# Altium schematic sheet power_supply.SchDoc
size A4; SheetNumber: 4; SheetTotal: 5
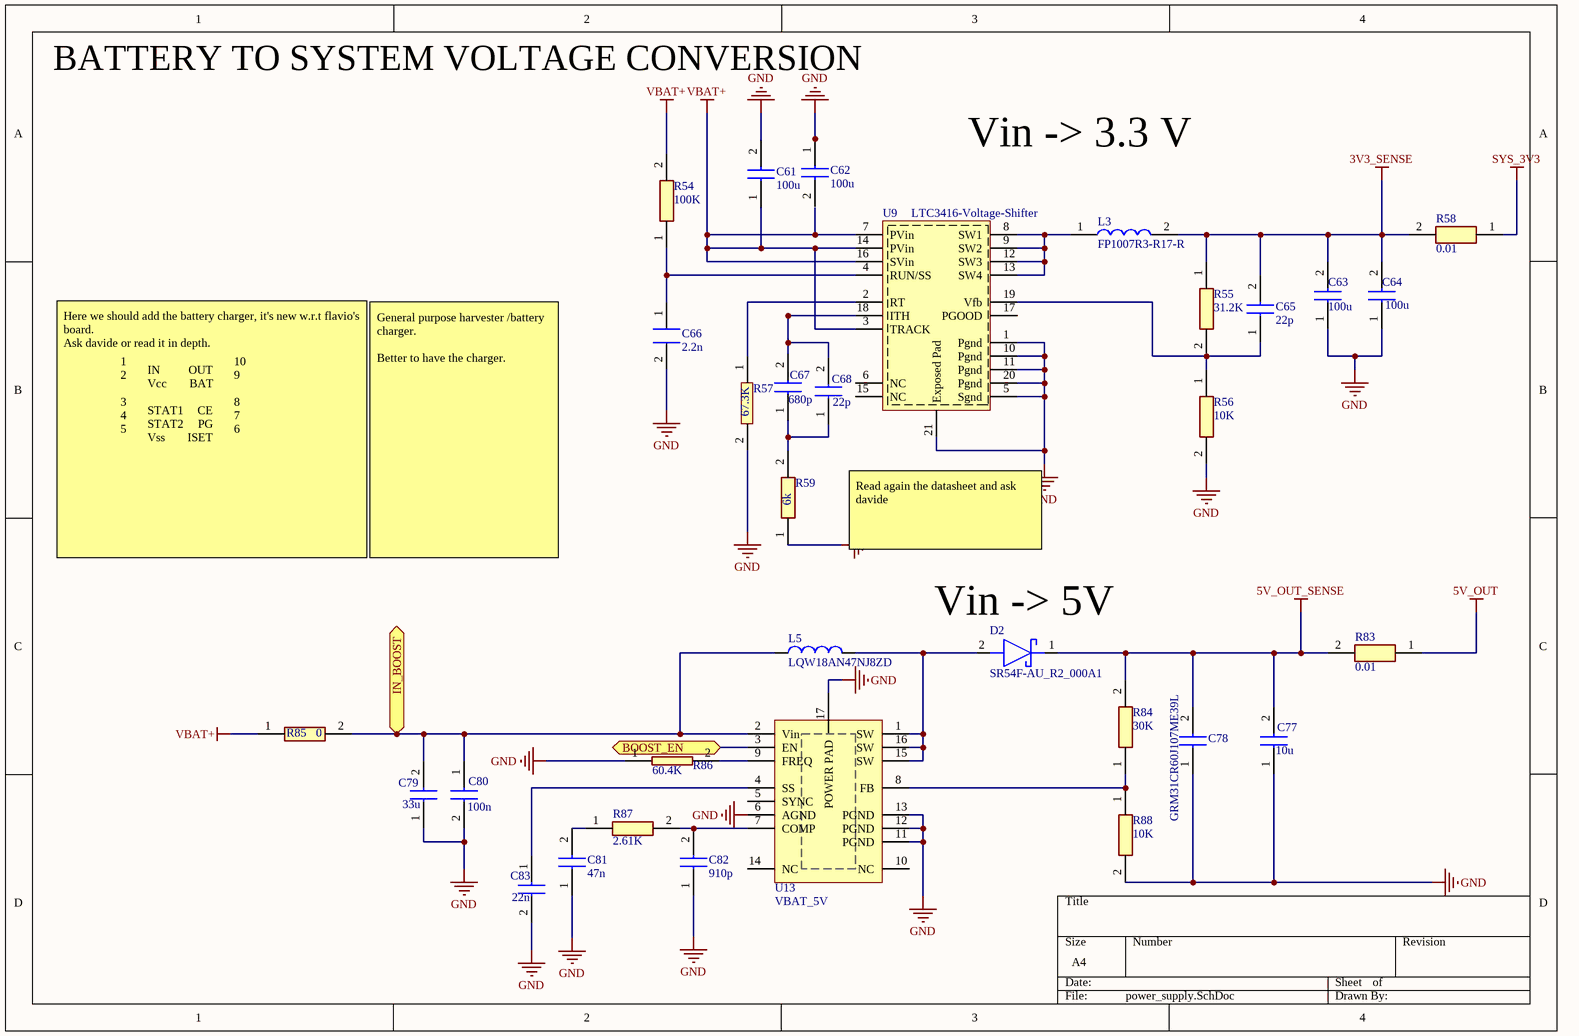
[diagram p0: power_supply.SchDoc]

## Parts
C61  100u
C62  100u
C63  100u
C64  100u
C65  22p  [CAPC0603X33N]
C66  2.2n
C67  680p  [CAPC2012X140N]
C68  22p  [CAPC0603X33N]
C77  10u  [CAPC1608X100N]
C78  GRM31CR60J107ME39L  [CAPC3216X180N]
C79  33u  [C2012_Commercial]
C80  100n  [CAPC1608X87N]
C81  47n  [CAPC2012X90N]
C82  910p
C83  22n  [CAPC2012X90N]
D2  SR54F-AU_R2_000A1  [SODFL5336X110N]
L3  FP1007R3-R17-R
L5  LQW18AN47NJ8ZD  [INDC1609X100N]
R54  100K  [RESC2012X60N]
R55  31.2K  [RESC1005X37N]
R56  10K  [ERJ3EK_(0603)]
R57  67.3K
R58  0.01
R59  6k  [ERA6A_(0805)]
R83  0.01
R84  30K  [RESC1608X55N]
R85  0  [RESC1608X55N]
R86  60.4K
R87  2.61K  [RESC1608X50N]
R88  10K  [ERJ3EK_(0603)]
U8  TI_Battery_Charger
U9  LTC3416-Voltage-Shifter
U13  VBAT_5V  [QFN50P300X300X80-17N-D]

## Ports
BOOST_EN (bidir), IN_BOOST (bidir)

## Nets
3V3_SENSE: C63.2 C64.2 C65.2 L3.2 R55.1 R58.2
5V_OUT: R83.1
5V_OUT_SENSE: C77.2 C78.2 D2.1(K) R83.2 R84.2
GND: C61.2 C62.1 C63.1 C64.1 C66.2 C77.1 C78.1 C79.1 C80.2 C81.1 C82.1 C83.2 R56.2 R57.2 R59.1 R86.1 R88.2 U9.1(Pgnd) U9.5(Sgnd) U9.10(Pgnd) U9.11(Pgnd) U9.20(Pgnd) U9.21(Exposed_Pad) U13.6(AGND) U13.11(PGND) U13.12(PGND) U13.13(PGND) U13.17(POWER_PAD)
SYS_3V3: R58.1
VBAT+: C61.1 R54.2 R85.1 U9.3(TRACK) U9.7(PVin) U9.14(PVin) U9.16(SVin)
BOOST_EN: U13.3(EN) ; port BOOST_EN
IN_BOOST: C79.2 C80.1 L5.1 R85.2 U13.2(Vin) ; port IN_BOOST
NetC65_1: C65.1 R55.2 R56.1 U9.19(Vfb)
NetC66_1: C66.1 R54.1 U9.4(RUN/SS)
NetC67_1: C67.1 C68.1 R59.2
NetC67_2: C67.2 C68.2 U9.18(ITH)
NetC81_2: C81.2 R87.1
NetC82_2: C82.2 R87.2 U13.7(COMP)
NetC83_1: C83.1 U13.4(SS)
NetD2_2: D2.2(A) L5.2 U13.1(SW) U13.15(SW) U13.16(SW)
NetL3_1: L3.1 U9.8(SW1) U9.9(SW2) U9.12(SW3) U9.13(SW4)
NetR57_1: R57.1 U9.2(RT)
NetR84_1: R84.1 R88.1 U13.8(FB)
NetR86_2: R86.2 U13.9(FREQ)

Not connected (* = marked no-connect by the designer): C62 2; U8 1(IN) 2(Vcc) 3(STAT1) 4(STAT2) 5(Vss) 6(ISET) 7(PG) 8(CE) 9(BAT) 10(OUT); U9 6(NC) 15(NC) 17(PGOOD); U13 5(SYNC) 10(NC) 14(NC)

## Notes on the sheet
- BATTERY TO SYSTEM VOLTAGE CONVERSION
- Vin -> 3.3 V
- To compute the value of Inductance here, I used the following formula:
  L = (Vout/f*deltaIl(max))(1 - (Vout/Vin(max)))
  L = (3.3V / 4MHz * 0.4(4A)) * (1 - 3.3V/5V)
  L = 0.17 uH
- (near U9) Rt = (3.08*10^11/f) - 10K with f = 4MHz.
  RT: Oscillator Resistor Input. Connecting a resistor
  to ground from this pin sets the switching frequency.
  We can decrease the frequency by increasing this resistor
- (near U9) Applying a voltage
  that is less than 0.8V to this pin enables tracking. I decided to disable this feature so I just simply connect it to high voltage
- ITH:
  Error Amplifier Compensation Point. The
  current comparator threshold increases with this control
  voltage. Nominal voltage range for this pin is from 0.2V to
  1.4V with
  This I copied from the datasheet example, we should discuss it too.
- (near U9) RUN_SS pin: Run Control and Soft-Start Input. Forcing
  this pin below 0.5V shuts down the LTC3416. I tunned this to have 1msec of start time. It can be also directly connected to VBAT.
  If we want to perform a duty cycling we should put a circuit here to decrease this to less than 0.5 V
- PGOOD:
  Power Good Output. Open-drain logic
  output that is pulled to ground when the output voltage is
  not within ±7.5% of the regulation point.
  This I didn't understand how to do it, so we should discuss it together.
  We can leave it / put a test point to use it when it's essential.
- (near R56) Vout = 0.8(1 + Rup/Rdown)
  For this example, it is:
  Vout = 0.8(1 + R55/R56) = 0.8(1+10/32) = 3.296 V
- (near U8) Here we should add the battery charger, it's new w.r.t flavio's board.
  Ask davide or read it in depth.
- General purpose harvester /battery charger.
  Better to have the charger.
- Read again the datasheet and ask davide
- (near D2) Vin -> 5V

## Library data of the parts
C61-C64 = C4532X5R0J107M280KA: TDK         C4532X5R0J107M280KA             SMD Multilayer Ceramic Capacitor, 1812 [4532 Metric], 100 F, 6.3 V,  20%, X5R, C Series; Capacitance: 100uF; Voltage Rating: 6.3V; Supplier 1: RSComponents; Supplier Part Number 1: 7416783; Manufacturer: TDK; Manufacturer Part Number: C4532X5R0J107M280KA; RoHS: Yes; Category: Ceramic Capacitors; Stock 1: 4; Mount: Surface Mount; Case/Package: 1812; Number of Pins: 2; Case Code (Metric): 4532; Case Code (Imperial): 1812; Weight: 0.000952oz; Dielectric Material: Ceramic; Min Operating Temperature: -55°C; Max Operating Temperature: 85°C; Tolerance: 20%; Packaging: Tape and Reel; Package Quantity: 1; Voltage Rating (DC): 6.3V; Dielectric: X5R; Termination: SMD/SMT; Series: C; Resistor Type: Ceramic; Voltage: 6.3V; Length: 4.5mm; Width: 0.126inch; Height: 2.8mm; Depth: 3.2mm; Thickness: 0.122inch; Radiation Hardening: No; REACH SVHC: No SVHC; Lead Free: Lead Free; RoHS Compliant: Yes; ComponentLink1URL: https://datasheet.ciiva.com/11788/0900766b80c1bb00-11788289.pdf?src-supplier=RSComponents; ComponentLink1Description: https://datasheet.ciiva.com/11788/0900766b80c1bb00-11788289.pdf?src-supplier=RSComponents; ComponentLink2URL: https://datasheet.ciiva.com/24216/c4532x5r0j107m280ka-265668-24216530.pdf?src-supplier=Mouser; ComponentLink2Description: https://datasheet.ciiva.com/24216/c4532x5r0j107m280ka-265668-24216530.pdf?src-supplier=Mouser; ComponentLink3URL: https://datasheet.ciiva.com/6283/tdkmlcccaprange-6283834.pdf?src-supplier=Digi-Key; ComponentLink3Description: https://datasheet.ciiva.com/6283/tdkmlcccaprange-6283834.pdf?src-supplier=Digi-Key; ComponentLink4URL: https://datasheet.ciiva.com/16397/e412-c-16397098.pdf?src-supplier=Future+Electronics; ComponentLink4Description: https://datasheet.ciiva.com/16397/e412-c-16397098.pdf?src-supplier=Future+Electronics; ComponentLink5URL: https://datasheet.ciiva.com/6283/tdkmlcccaprange-6283837.pdf?src-supplier=Digi-Key; ComponentLink5Description: https://datasheet.ciiva.com/6283/tdkmlcccaprange-6283837.pdf?src-supplier=Digi-Key
C65 C68 = CBR02C220F9GAC: Capacitor; Manufacturer_Name: Kemet; Datasheet Link: https://datasheet.datasheetarchive.com/originals/distributors/Datasheets-DGA10/2407502.pdf; Height: 0.33mm; Manufacturer_Part_Number: CBR02C220F9GAC
C66 = C0603C222K2RECAUTO: Cap Cer 0603 2.2nF 200V X7R 4K 7" Reel; Manufacturer: KEMET; Supplier 1: Mouser; Supplier Part Number 1: 80-C0603C222K2REAUTO; Manufacturer Part Number: C0603C222K2RECAUTO; RoHS: Yes; Category: Ceramic Capacitors; Stock 1: 16227; RoHS Compliant: Yes
C67 = C0805C681JCTACAUTO: Capacitor; Manufacturer_Name: Kemet; Datasheet Link: https://www.kemet.com/specsheet/C0805C681JCTACAUTO; Height: 1.4mm; Manufacturer_Part_Number: C0805C681JCTACAUTO
C77 = LMK107BBJ106KALT: Capacitor; Manufacturer_Name: TAIYO YUDEN; Datasheet Link: https://componentsearchengine.com//LMK107BBJ106KALT.pdf; Height: 1mm; Mouser2 Part Number: 963-LMK107BBJ106KALT; Mouser2 Price/Stock: https://www.mouser.com/Search/Refine.aspx?Keyword=963-LMK107BBJ106KALT; Manufacturer_Part_Number: LMK107BBJ106KALT
C78 = GRM31CR60J107ME39L: Capacitor; Manufacturer_Name: Murata Electronics; Datasheet Link: https://componentsearchengine.com//GRM31CR60J107ME39L.pdf; Height: 1.8mm; Mouser2 Part Number: 81-GRM31CR60J107ME9L; Mouser2 Price/Stock: https://www.mouser.com/Search/Refine.aspx?Keyword=81-GRM31CR60J107ME9L; Manufacturer_Part_Number: GRM31CR60J107ME39L
C79 = C2012X5R1A336M125AC: Capacitor; Manufacturer_Name: TDK; Datasheet Link: https://product.tdk.com/system/files/dam/doc/product/capacitor/ceramic/mlcc/catalog/mlcc_commercial_general_en.pdf; Height: 0.75mm; Manufacturer_Part_Number: C2012X5R1A336M125AC
C80 = 885012206071: Capacitor; Manufacturer_Name: Wurth Elektronik; Datasheet Link: https://katalog.we-online.com/pbs/datasheet/885012206071.pdf; Height: 0.87mm; Manufacturer_Part_Number: 885012206071
C81 = 885012207070: Capacitor; Manufacturer_Name: Wurth Elektronik; Datasheet Link: https://katalog.we-online.com/pbs/datasheet/885012207070.pdf; Height: 0.9mm; Manufacturer_Part_Number: 885012207070
C82 = 08055C911KAT2A: Cap Ceramic 910pF 50V X7R 10% SMD 0805 125°C T/R; Manufacturer: Kyocera AVX; Supplier 1: Mouser; Supplier Part Number 1: 581-08055C911KAT2A; Manufacturer Part Number: 08055C911KAT2A; RoHS: Yes; Category: Ceramic Capacitors; Stock 1: 8767; Mount: Surface Mount; Case/Package: 0805; Number of Pins: 2; Case Code (Metric): 2012; Case Code (Imperial): 0805; Min Operating Temperature: -55°C; Max Operating Temperature: 125°C; Package Quantity: 12000; Capacitance: 910pF; Voltage Rating: 50V; Tolerance: 10%; Packaging: Tape and Reel; Termination: SMD/SMT; Voltage Rating (DC): 50V; Dielectric: X7R; Length: 0.079inch; Width: 0.049inch; Thickness: 0.037inch; Depth: 1.25mm; ComponentLink1URL: https://datasheet.ciiva.com/204/cx7r-204753.pdf?src-supplier=Digi-Key; ComponentLink1Description: https://datasheet.ciiva.com/204/cx7r-204753.pdf?src-supplier=Digi-Key; ComponentLink2URL: https://datasheet.ciiva.com/13190/cx7r-13190460.pdf?src-supplier=Mouser; ComponentLink2Description: https://datasheet.ciiva.com/13190/cx7r-13190460.pdf?src-supplier=Mouser
C83 = 885012207094: Capacitor; Manufacturer_Name: Wurth Elektronik; Datasheet Link: https://componentsearchengine.com//885012207094.pdf; Height: 0.9mm; Mouser2 Part Number: 710-885012207094; Mouser2 Price/Stock: https://www.mouser.com/Search/Refine.aspx?Keyword=710-885012207094; Manufacturer_Part_Number: 885012207094
D2 = SR54F-AU_R2_000A1: Schottky Diode; Manufacturer_Name: PANJIT; Datasheet Link: https://www.mouser.jp/datasheet/2/1057/SR54F-AU-1877118.pdf; Height: 1.1mm; Manufacturer_Part_Number: SR54F-AU_R2_000A1
L3 = FP1007R3-R17-R: General Purpose Inductor, 0.17uH, 10%, 1 Element, Ferrite-Core, SMD, 4131; Manufacturer: Eaton Bussmann; Current Rating: 61A; Saturation Current: 66A; Shielding: Unshielded; Inductance: 170nH; DC Resistance (DCR): 0.29mR; Test Frequency: 100kHz; Self Resonant Frequency: 2MHz; Supplier 1: Digi-Key; Supplier Part Number 1: 513-1684-1-ND; Manufacturer Part Number: FP1007R3-R17-R; RoHS: Yes; Category: Fixed Inductors; Stock 1: 16517; Mount: Surface Mount; Case/Package: 1007; Core Material: Ferrite; Weight: 0.070548oz; Min Operating Temperature: -40°C; Max Operating Temperature: 125°C; Tolerance: 10%; Packaging: Tape and Reel; Package Quantity: 650; Max DC Current: 61A; Termination: SMD/SMT; Length: 10.2mm; Width: 7.8mm; Height: 7.3mm; Depth: 8mm; Radiation Hardening: No; Military Standard: Not; Lead Free: Lead Free; ComponentLink1URL: https://datasheet.ciiva.com/25630/0900766b8116a2db-25630987.pdf?src-supplier=RSComponents; ComponentLink1Description: https://datasheet.ciiva.com/25630/0900766b8116a2db-25630987.pdf?src-supplier=RSComponents; ComponentLink2URL: https://datasheet.ciiva.com/26858/getdatasheetpartid-711055-26858509.pdf?src-supplier=Verical; ComponentLink2Description: https://datasheet.ciiva.com/26858/getdatasheetpartid-711055-26858509.pdf?src-supplier=Verical; ComponentLink3URL: https://datasheet.ciiva.com/16439/79793630-1b1e-49f8-a6d0-ea9b2be9f2e4-16439083.pdf?src-supplier=Future+Electronics; ComponentLink3Description: https://datasheet.ciiva.com/16439/79793630-1b1e-49f8-a6d0-ea9b2be9f2e4-16439083.pdf?src-supplier=Future+Electronics
L5 = LQW18AN47NJ8ZD: FIXED IND 47NH 830MA 230 MOHM; Package: None; Price: None; Value: *; MP: LQW18AN47NJ8ZD; Availability: Unavailable
R54 = CHV0805AFX-1003ELF: Resistor; Manufacturer_Name: Bourns; Height: 0.6mm; Manufacturer_Part_Number: CHV0805AFX-1003ELF
R55 = MCS04020D3122BE100: Resistor; Manufacturer_Name: Vishay; Datasheet Link: http://www.vishay.com/docs/28705/mcx0x0xpro.pdf; Height: 0.37mm; Manufacturer_Part_Number: MCS04020D3122BE100
R56 R88 = ERJ-3EKF1002V: Resistor; Manufacturer_Name: Panasonic; Datasheet Link: https://componentsearchengine.com//ERJ-3EKF1002V.pdf; Height: 0.55mm; Mouser2 Part Number: 667-ERJ-3EKF1002V; Mouser2 Price/Stock: https://www.mouser.com/Search/Refine.aspx?Keyword=667-ERJ-3EKF1002V; Manufacturer_Part_Number: ERJ-3EKF1002V
R57 = RN732ATTD6732B25: Res 67.3K Ohm 0.1% 1/10W 0805; Manufacturer: KOA Speer; Supplier 1: Mouser; Supplier Part Number 1: 660-RN732ATTD6732B25; Manufacturer Part Number: RN732ATTD6732B25; RoHS: Yes; Category: Chip SMD Resistors; Stock 1: 2067; RoHS Compliant: Yes
R58 R83 = LVK12R010DER (2): Res Metal Alloy 1206 0.01 Ohm 0.5% 0.5W(1/2W) ±50ppm/C Pad SMD T/R; Manufacturer: Ohmite; Resistance: 10mR; Power Rating: 500mW; Temperature Coefficient: 50ppm/°C; Supplier 1: Digi-Key; Supplier Part Number 1: LVK12R010DERCT-ND; Manufacturer Part Number: LVK12R010DER; RoHS: Yes; Category: Chip SMD Resistors; Stock 1: 125609; Mount: Surface Mount; Case/Package: 1206; Case Code (Imperial): 1206; Case Code (Metric): 3216; Weight: 0.000571oz; Min Operating Temperature: -40°C; Max Operating Temperature: 125°C; Tolerance: 0.5%; Packaging: Tape and Reel; Package Quantity: 1; Resistor Type: Thick Film,Metal Film,Thin Film; Termination: SMD/SMT; Number of Terminations: 4; Max Power Dissipation: 500mW; Features: Moisture Resistant; Length: 3.2mm; Width: 1.6mm; Height: 0.5mm; Depth: 1.6mm; REACH SVHC: Unknown; RoHS Compliant: Yes; ComponentLink1URL: https://datasheet.ciiva.com/7937/575641-7937848.pdf?src-supplier=Element14; ComponentLink1Description: https://datasheet.ciiva.com/7937/575641-7937848.pdf?src-supplier=Element14; ComponentLink2URL: https://datasheet.ciiva.com/7937/575641-7937847.pdf?src-supplier=Element14; ComponentLink2Description: https://datasheet.ciiva.com/7937/575641-7937847.pdf?src-supplier=Element14; ComponentLink3URL: https://datasheet.ciiva.com/7938/lvk-7938167.pdf?src-supplier=Element14; ComponentLink3Description: https://datasheet.ciiva.com/7938/lvk-7938167.pdf?src-supplier=Element14; ComponentLink4URL: https://datasheet.ciiva.com/5469/lvk-5469173.pdf?src-supplier=Mouser; ComponentLink4Description: https://datasheet.ciiva.com/5469/lvk-5469173.pdf?src-supplier=Mouser; ComponentLink5URL: https://datasheet.ciiva.com/16756/70024650-16756989.pdf?src-supplier=Allied+Electronics; ComponentLink5Description: https://datasheet.ciiva.com/16756/70024650-16756989.pdf?src-supplier=Allied+Electronics; ComponentLink6URL: https://datasheet.ciiva.com/15865/40lvk-15865303.pdf?src-supplier=Onlinecomponents.com; ComponentLink6Description: https://datasheet.ciiva.com/15865/40lvk-15865303.pdf?src-supplier=Onlinecomponents.com; ComponentLink7URL: https://datasheet.ciiva.com/2482/res-lvk-2482375.pdf?src-supplier=Digi-Key; ComponentLink7Description: https://datasheet.ciiva.com/2482/res-lvk-2482375.pdf?src-supplier=Digi-Key; ComponentLink8URL: https://datasheet.ciiva.com/2482/res-lvk-2482376.pdf?src-supplier=Digi-Key; ComponentLink8Description: https://datasheet.ciiva.com/2482/res-lvk-2482376.pdf?src-supplier=Digi-Key; ComponentLink9URL: https://datasheet.ciiva.com/2482/res-lvk-2482374.pdf?src-supplier=Digi-Key; ComponentLink9Description: https://datasheet.ciiva.com/2482/res-lvk-2482374.pdf?src-supplier=Digi-Key
R59 = ERA-6ARB6041V: Resistor; Manufacturer_Name: Panasonic; Datasheet Link: http://industrial.panasonic.com/cdbs/www-data/pdf/RDM0000/AOA0000C307.pdf; Height: 0.6mm; Manufacturer_Part_Number: ERA-6ARB6041V
R84 = CRCW060330K0FKEAC: Resistor; Manufacturer_Name: Vishay; Datasheet Link: https://componentsearchengine.com//CRCW060330K0FKEAC.pdf; Height: 0.55mm; Mouser2 Part Number: 71-CRCW060330K0FKEAC; Mouser2 Price/Stock: https://www.mouser.com/Search/Refine.aspx?Keyword=71-CRCW060330K0FKEAC; Manufacturer_Part_Number: CRCW060330K0FKEAC
R85 = RC0603FR-070RL: Resistor; Manufacturer_Name: YAGEO (PHYCOMP); Height: 0.55mm; Manufacturer_Part_Number: RC0603FR-070RL
R86 = CRCW060360K4FKEAC: Res Thick Film 0603 60.4K Ohm 1% 1/10W ±100ppm/°C Molded SMD Paper T/R; Manufacturer: Vishay; Power Rating: 100mW; Resistance: 60.4kR; Supplier 1: Digi-Key; Supplier Part Number 1: 541-5506-1-ND; Manufacturer Part Number: CRCW060360K4FKEAC; Category: Chip SMD Resistors; Stock 1: 86964; Case/Package: 0603; Tolerance: 1%; Lead Free: Lead Free
R87 = CRCW06032K61FKEA: Resistor; Manufacturer_Name: Vishay; Datasheet Link: http://www.vishay.com/docs/20035/dcrcwe3.pdf; Height: 0.5mm; Manufacturer_Part_Number: CRCW06032K61FKEA
U8 = BQ24012DRCR: 1-cell, 1-A, linear Li-ion battery charger w/ FET, AC present & charge enable in QFN-12 10-VSON -40 to 85; Manufacturer: Texas Instruments; Output Voltage: 4.2V; Output Current: 1A; Min Supply Voltage: 3V; Max Supply Voltage: 16.5V; Number of Cells: 1; Supplier 1: Digi-Key; Supplier Part Number 1: 296-13715-1-ND; Manufacturer Part Number: BQ24012DRCR; RoHS: Yes; Category: power; Stock 1: 1348; Number of Pins: 10; Weight: 0.000885oz; Contact Plating: Gold; Min Operating Temperature: -40°C; Max Operating Temperature: 125°C; Packaging: Tape and Reel; Package Quantity: 3000; Min Input Voltage: 3V; Max Output Current: 1A; Max Charge Current: 1A; Length: 3mm; Width: 3mm; Height: 0.9mm; Radiation Hardening: No; Lead Free: Lead Free; RoHS Compliant: Yes; REACH SVHC: No SVHC; ComponentLink1URL: https://datasheet.ciiva.com/3213/bq24018-3213937.pdf?src-supplier=Avnet; ComponentLink1Description: https://datasheet.ciiva.com/3213/bq24018-3213937.pdf?src-supplier=Avnet; ComponentLink2URL: https://datasheet.ciiva.com/15114/getdatasheetpartid-256151-15114566.pdf?src-supplier=Verical; ComponentLink2Description: https://datasheet.ciiva.com/15114/getdatasheetpartid-256151-15114566.pdf?src-supplier=Verical; ComponentLink3URL: https://datasheet.ciiva.com/26875/bq24012drcr-26875237.pdf?src-supplier=IIIC; ComponentLink3Description: https://datasheet.ciiva.com/26875/bq24012drcr-26875237.pdf?src-supplier=IIIC; ComponentLink4URL: https://datasheet.ciiva.com/22642/1862453-22642958.pdf?src-supplier=Element14; ComponentLink4Description: https://datasheet.ciiva.com/22642/1862453-22642958.pdf?src-supplier=Element14; ComponentLink5URL: https://datasheet.ciiva.com/1932/bq24014-1932389.pdf?src-supplier=Digi-Key; ComponentLink5Description: https://datasheet.ciiva.com/1932/bq24014-1932389.pdf?src-supplier=Digi-Key; ComponentLink6URL: https://datasheet.ciiva.com/1932/bq24014-1932388.pdf?src-supplier=Digi-Key; ComponentLink6Description: https://datasheet.ciiva.com/1932/bq24014-1932388.pdf?src-supplier=Digi-Key; ComponentLink7URL: https://datasheet.ciiva.com/1932/bq24014-1932390.pdf?src-supplier=Digi-Key; ComponentLink7Description: https://datasheet.ciiva.com/1932/bq24014-1932390.pdf?src-supplier=Digi-Key; ComponentLink8URL: https://datasheet.ciiva.com/26250/bq24012-26250366.pdf?src-supplier=Avnet+Europe; ComponentLink8Description: https://datasheet.ciiva.com/26250/bq24012-26250366.pdf?src-supplier=Avnet+Europe; category: Battery
U9 = LTC3416EFE#PBF: Conv DC-DC 2.25V to 5.5V Synchronous Step Down Single-Out 0.8V to 5V 4A Automotive 20-Pin TSSOP EP; Manufacturer: Analog Devices; Efficiency: 95%; Number of Outputs: 1; Switching Frequency: 4MHz; Synchronous Rectifier: Yes; Min Output Voltage: 800mV; Output Type: Adjustable; Output Configuration: Positive; Supplier 1: Digi-Key; Supplier Part Number 1: LTC3416EFE#PBF-ND; Manufacturer Part Number: LTC3416EFE#PBF; Category: Power; Stock 1: 1587; Mount: Surface Mount; Case/Package: TSSOP; Number of Pins: 20; Min Operating Temperature: -40°C; Max Operating Temperature: 85°C; Min Input Voltage: 2.25V; Max Output Current: 4A; Max Input Voltage: 5.5V; Output Voltage: 5V; Output Current: 4A; Package Quantity: 74; Packaging: Rail/Tube; Max Output Voltage: 5V; Series: -; Length: 6.6mm; Width: 4.5mm; Height: 1.05mm; Radiation Hardening: No; REACH SVHC: No SVHC; Lead Free: Lead Free; RoHS Compliant: Yes; ComponentLink1URL: https://datasheet.ciiva.com/2025/2995-2025099.pdf?src-supplier=Digi-Key; ComponentLink1Description: https://datasheet.ciiva.com/2025/2995-2025099.pdf?src-supplier=Digi-Key; ComponentLink2URL: https://datasheet.ciiva.com/15112/getdatasheetpartid-82273-15112776.pdf?src-supplier=Verical; ComponentLink2Description: https://datasheet.ciiva.com/15112/getdatasheetpartid-82273-15112776.pdf?src-supplier=Verical; ComponentLink3URL: https://datasheet.ciiva.com/26898/ltc3416efe-pbf-26898981.pdf?src-supplier=IIIC; ComponentLink3Description: https://datasheet.ciiva.com/26898/ltc3416efe-pbf-26898981.pdf?src-supplier=IIIC; ComponentLink4URL: https://datasheet.ciiva.com/7312/1727688-7312092.pdf?src-supplier=Newark; ComponentLink4Description: https://datasheet.ciiva.com/7312/1727688-7312092.pdf?src-supplier=Newark; ComponentLink5URL: https://datasheet.octopart.com/LTC3416EFE%23PBF-Analog-Devices-datasheet-17021874.pdf?src-supplier=Linear+Technology; ComponentLink5Description: https://datasheet.octopart.com/LTC3416EFE%23PBF-Analog-Devices-datasheet-17021874.pdf?src-supplier=Linear+Technology; ComponentLink6URL: https://sigma.octopart.com/57693649/technical_drawing/Linear-Technology-LTC3416EFE%23PBF.pdf?src-supplier=Linear+Technology; ComponentLink6Description: https://sigma.octopart.com/57693649/technical_drawing/Linear-Technology-LTC3416EFE%23PBF.pdf?src-supplier=Linear+Technology; ComponentLink7URL: https://datasheet.octopart.com/LTC3416EFE%23PBF-Linear-Technology-datasheet-604372.pdf?src-supplier=Element14; ComponentLink7Description: https://datasheet.octopart.com/LTC3416EFE%23PBF-Linear-Technology-datasheet-604372.pdf?src-supplier=Element14; ComponentLink8URL: https://datasheet.octopart.com/LTC3416EFE%23PBF-Linear-Technology-datasheet-14167519.pdf?src-supplier=IIIC; ComponentLink8Description: https://datasheet.octopart.com/LTC3416EFE%23PBF-Linear-Technology-datasheet-14167519.pdf?src-supplier=IIIC
U13 = TPS55340QRTERQ1: Conv DC-DC 2.9V to 38V Step Up Single-Out 2.9V to 38V 5A Automotive 16-Pin WQFN EP T/R; Manufacturer: Texas Instruments; Number of Outputs: 1; Output Current: 5.25A; Switching Frequency: 2.55MHz; Synchronous Rectifier: No; Quiescent Current: 500uA; Topology: Boost,Flyback,SEPIC; Output Type: Adjustable; Supplier 1: Mouser; Supplier Part Number 1: 595-TPS55340QRTERQ1; Manufacturer Part Number: TPS55340QRTERQ1; RoHS: Yes; Category: Power Supply Modules; Stock 1: 60; Mount: Surface Mount; Number of Pins: 16; Contact Plating: Gold; Min Operating Temperature: -40°C; Max Operating Temperature: 125°C; Packaging: Tape and Reel; Output Voltage: 38V; Max Output Current: 5A; Min Input Voltage: 2.9V; Max Input Voltage: 38V; Min Output Voltage: 2.9V; Max Output Voltage: 38V; Operating Supply Voltage: 38V; Lead Free: Lead Free; RoHS Compliant: Yes; ComponentLink1URL: http://components.arrow.com/part/dataview/66951772S909397N7713?src-supplier=Arrow+Electronics; ComponentLink1Description: http://components.arrow.com/part/dataview/66951772S909397N7713?src-supplier=Arrow+Electronics; ComponentLink2URL: http://www.ti.com/general/docs/lit/getliterature.tsp?genericPartNumber=TPS55340-Q1&&fileType=pdf&src-supplier=Avnet; ComponentLink2Description: http://www.ti.com/general/docs/lit/getliterature.tsp?genericPartNumber=TPS55340-Q1&&fileType=pdf&src-supplier=Avnet; ComponentLink3URL: http://www.ti.com/general/docs/lit/getliterature.tsp?genericPartNumber=TPS55340-Q1&&fileType=pdf&src-supplier=Avnet+Asia; ComponentLink3Description: http://www.ti.com/general/docs/lit/getliterature.tsp?genericPartNumber=TPS55340-Q1&&fileType=pdf&src-supplier=Avnet+Asia; ComponentLink4URL: http://www.ti.com/lit/ds/symlink/tps55340-q1.pdf?src-supplier=Digi-Key; ComponentLink4Description: http://www.ti.com/lit/ds/symlink/tps55340-q1.pdf?src-supplier=Digi-Key